# Altium schematic sheet Nixie-imp-v1.SchDoc
size A4; Organization: Altium Limited; Address1: L3, 12a Rodborough Rd; Address2: Frenchs Forest; Address3: NSW; Address4: Australia 2086
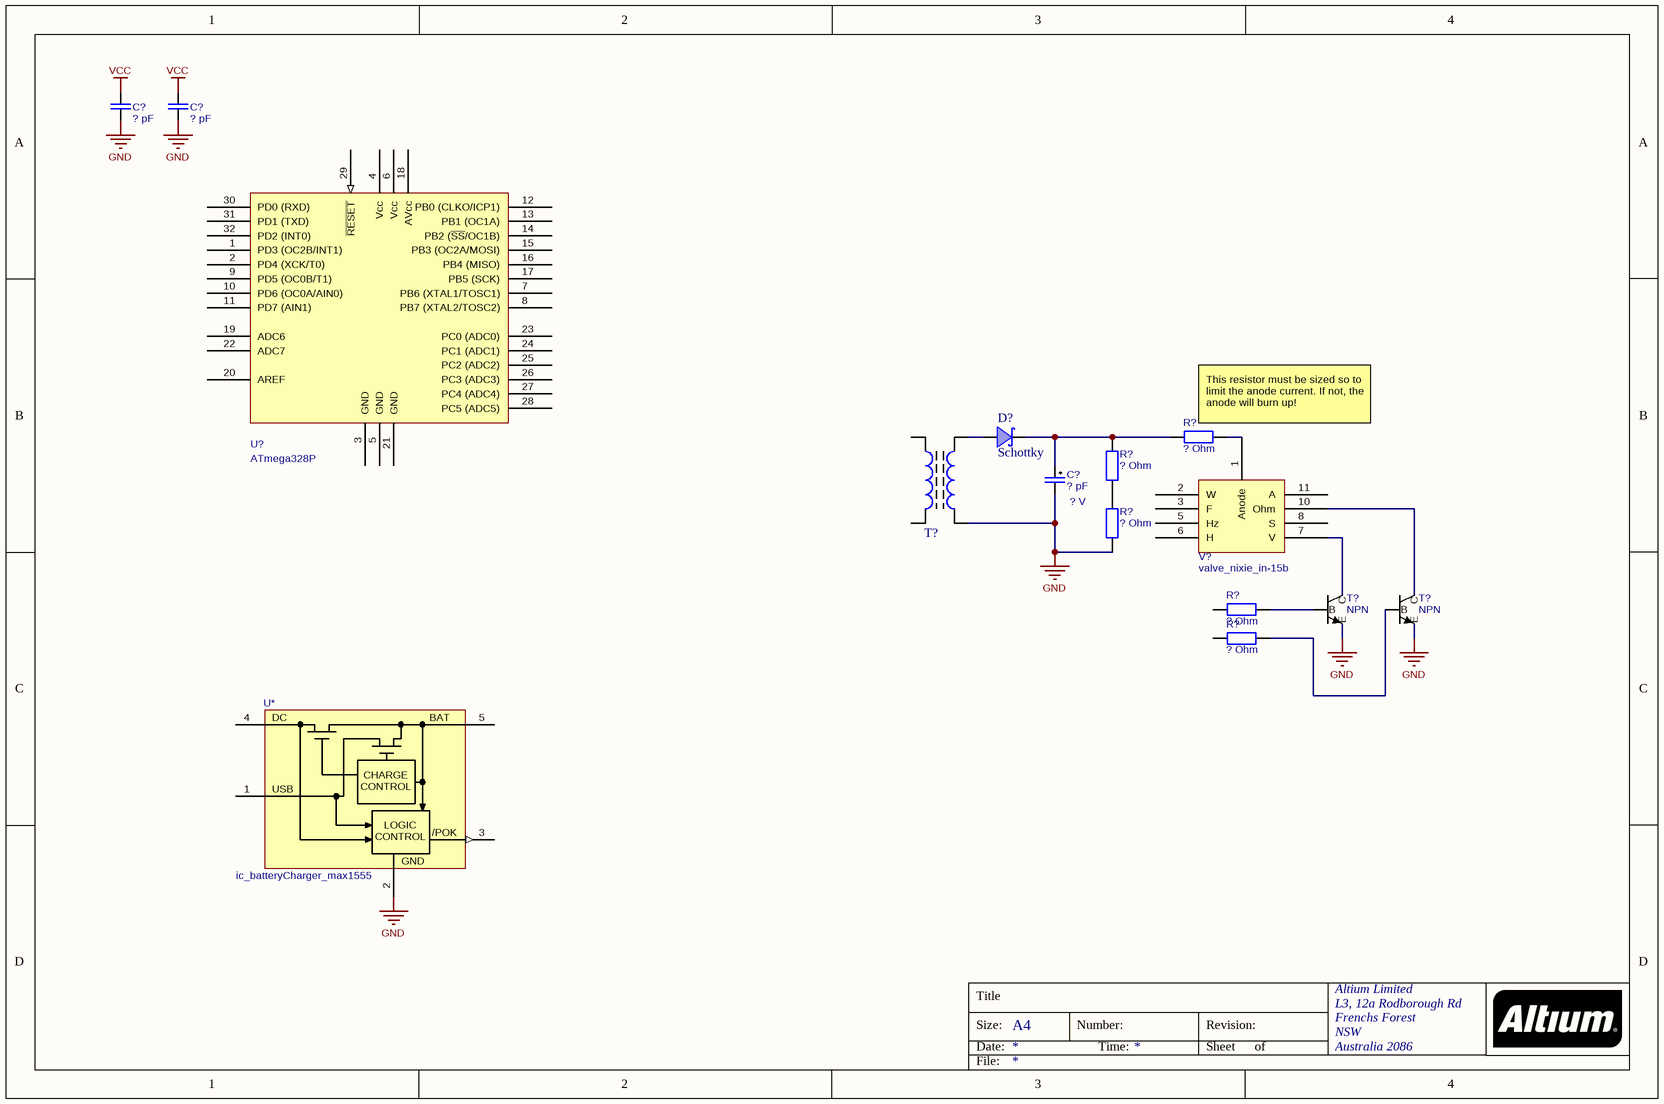
[diagram p0: Nixie-imp-v1.SchDoc]

## Parts
(Parts that share a designator on the sheet are numbered #1, #2 ... from top to bottom, then left to right.)
C?#1  ? pF
C?#2  ? pF
C?#3  ? pF  Voltage rating: ? V
D?  Schottky
R?#1  ? Ohm
R?#2  ? Ohm
R?#3  ? Ohm
R?#4  ? Ohm
R?#5  ? Ohm
T?#1  trans__genTransformerFerriteCore  (value not drawn)
T?#2  NPN
T?#3  NPN
U*  ic_batteryCharger_max1555
U?  ATmega328P  [ic_atmel_atmega328p]
V?  valve_nixie_in-15b

## Nets
GND: C?#1.1 C?#2.1 C?#3.1 R?#3.2 T?#1.4 T?#2.E T?#3.E U*.2(GND)
VCC: C?#1.2 C?#2.2
NetC?#3_2: C?#3.2 D?.2(C) R?#1.2 R?#2.1
NetD?_1: D?.1(A) T?#1.9
NetR?#1_1: R?#1.1 V?.1(Anode)
NetR?#2_2: R?#2.2 R?#3.1
NetR?#4_1: R?#4.1 T?#2.B
NetR?#5_1: R?#5.1 T?#3.B
NetT?#2_C: T?#2.C V?.7(V)
NetT?#3_C: T?#3.C V?.10(Ohm)

Not connected (* = marked no-connect by the designer): R?#4 2; R?#5 2; T?#1 1 2; U* 1(USB) 3(~{PO}K_~{(CH}G)) 4(DC) 5(BAT); U? 1(PD3_(OC2B/INT1)) 2(PD4_(XCK/T0)) 3(GND) 4(Vcc) 5(GND) 6(Vcc) 7(PB6_(XTAL1/TOSC1)) 8(PB7_(XTAL2/TOSC2)) 9(PD5_(OC0B/T1)) 10(PD6_(OC0A/AIN0)) 11(PD7_(AIN1)) 12(PB0_(CLKO/ICP1)) 13(PB1_(OC1A)) 14(PB2_(~{SS}/OC1B)) 15(PB3_(OC2A/MOSI)) 16(PB4_(MISO)) 17(PB5_(SCK)) 18(AVcc) 19(ADC6) 20(AREF) 21(GND) 22(ADC7) 23(PC0_(ADC0)) 24(PC1_(ADC1)) 25(PC2_(ADC2)) 26(PC3_(ADC3)) 27(PC4_(ADC4)) 28(PC5_(ADC5)) 29(~{RESET}) 30(PD0_(RXD)) 31(PD1_(TXD)) 32(PD2_(INT0)); V? 2(W) 3(F) 5(Hz) 6(H) 8(S) 11(A)

## Notes on the sheet
- (near R?#1) This resistor must be sized so to limit the anode current. If not, the anode will burn up!
- Title
- Size:
- Date:
- A4
- Number:
- Time:
- Revision:
- Sheet
- of
- File:
- (in symbol ic_batteryCharger_max1555) CHARGE / CONTROL; /POK; LOGIC / CONTROL

## Library data of the parts
C?#1 C?#2 = cap__genCapUnipol: Generic unipolarised capasitor; Voltage rating: ? V; Value: ? pF
C?#3 = cap__genCapPolar: Generic polarised capasitor; Value: ? pF
D? = dio__genSchottkyDiode: Generic Schottky Diode
R?#1-R?#5 = res__genResistor: Generic resistor; Watt rating: ? mW; Value: ? Ohm
T?#1 = trans__genTransformerFerriteCore: Generic transformer with ferrite core; Self inductance: ? mH; Turns ratio: *
T?#2 T?#3 = transi__genNPN: Generic NPN Transistor; Std: IEEE Std 315-1975
U* = ic_batteryCharger_max1555: MAX1551/1555 Li-Ion battery charger IC
U? = ic_atmel_atmega328p: Atmel 8 bit microcontroller; Supply voltage: *; Clock frequency: *
V? = valve_nixie_in-15b: IN-15b Nixie tube; Working voltage: 180V; Forward current: 3mA; Ignite voltage: *